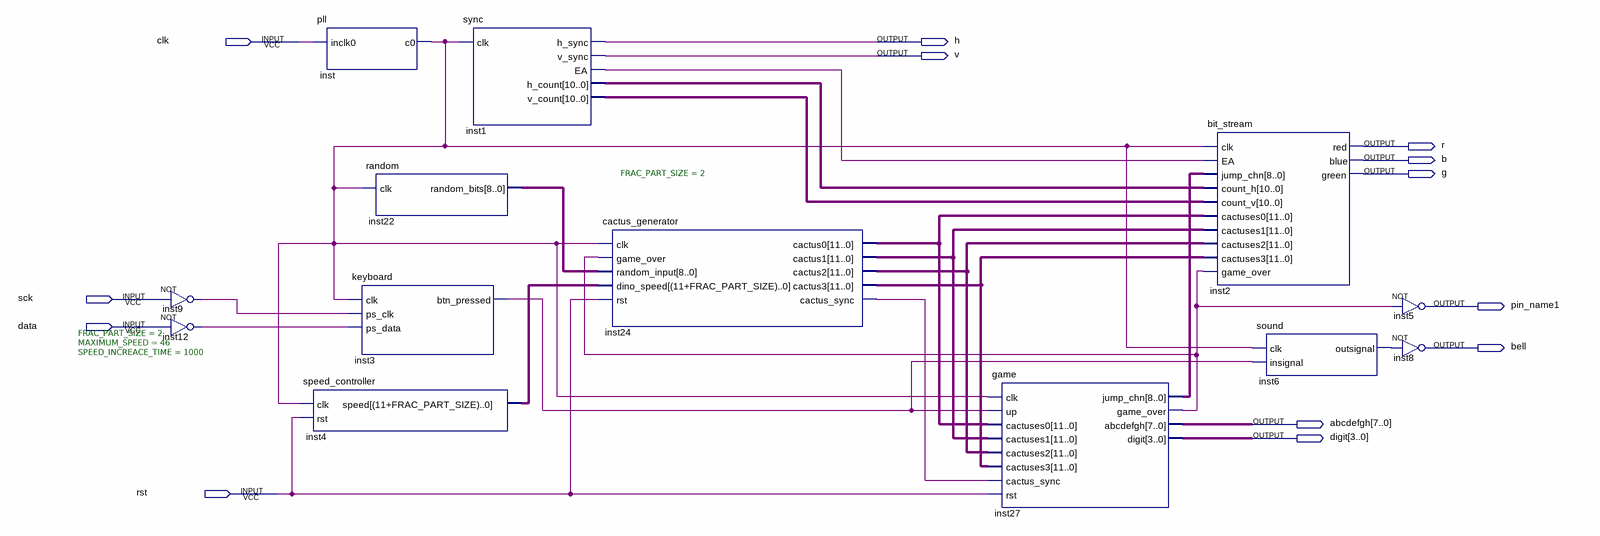
[diagram p0: schematic sheet]
// Quartus schematic vga.bdf as structural Verilog: 13 symbols, 13 pins
module vga (
  input  clk,
  input  sck,
  input  data,
  input  rst,
  output h,
  output v,
  output r,
  output b,
  output g,
  output pin_name1,
  output bell,
  output [7:0] abcdefgh,
  output [3:0] digit
);

  wire inst1_ea, inst3_btn_pressed, inst6_outsignal, inst9_out, inst12_out, inst24_cactus_sync,
       inst27_game_over, inst_c0;
  wire [8:0] inst22_random_bits, inst27_jump_chn;
  wire [10:0] inst1_h_count, inst1_v_count;
  wire [11:0] inst24_cactus0, inst24_cactus1, inst24_cactus2, inst24_cactus3;
  wire [13:0] inst4_speed;

  not inst9 (inst9_out, sck);
  not inst12 (inst12_out, data);
  speed_controller #(.FRAC_PART_SIZE(2), .MAXIMUM_SPEED(46), .SPEED_INCREACE_TIME(1000)) inst4 (
    .clk(inst_c0), .rst(rst), .speed(inst4_speed));
  pll inst (.inclk0(clk), .c0(inst_c0));
  random inst22 (.clk(inst_c0), .random_bits(inst22_random_bits));
  keyboard inst3 (.clk(inst_c0), .ps_clk(inst9_out), .ps_data(inst12_out), .btn_pressed(inst3_btn_pressed));
  sync inst1 (.clk(inst_c0), .h_sync(h), .v_sync(v), .EA(inst1_ea), .h_count(inst1_h_count), .v_count(inst1_v_count));
  cactus_generator #(.FRAC_PART_SIZE(2)) inst24 (
    .clk(inst_c0), .game_over(inst27_game_over), .random_input(inst22_random_bits), .dino_speed(inst4_speed),
    .rst(rst), .cactus0(inst24_cactus0), .cactus1(inst24_cactus1), .cactus2(inst24_cactus2),
    .cactus3(inst24_cactus3), .cactus_sync(inst24_cactus_sync));
  game inst27 (
    .clk(inst_c0), .up(inst3_btn_pressed), .cactuses0(inst24_cactus0), .cactuses1(inst24_cactus1),
    .cactuses2(inst24_cactus2), .cactuses3(inst24_cactus3), .cactus_sync(inst24_cactus_sync), .rst(rst),
    .jump_chn(inst27_jump_chn), .game_over(inst27_game_over), .abcdefgh(abcdefgh), .digit(digit));
  bit_stream inst2 (
    .clk(inst_c0), .EA(inst1_ea), .jump_chn(inst27_jump_chn), .count_h(inst1_h_count),
    .count_v(inst1_v_count), .cactuses0(inst24_cactus0), .cactuses1(inst24_cactus1),
    .cactuses2(inst24_cactus2), .cactuses3(inst24_cactus3), .game_over(inst27_game_over), .red(r), .blue(b),
    .green(g));
  sound inst6 (.clk(inst_c0), .insignal(inst3_btn_pressed), .outsignal(inst6_outsignal));
  not inst5 (pin_name1, inst27_game_over);
  not inst8 (bell, inst6_outsignal);
endmodule
